# EAGLE schematic ProcessingUnit (EAGLE 9.6.2)
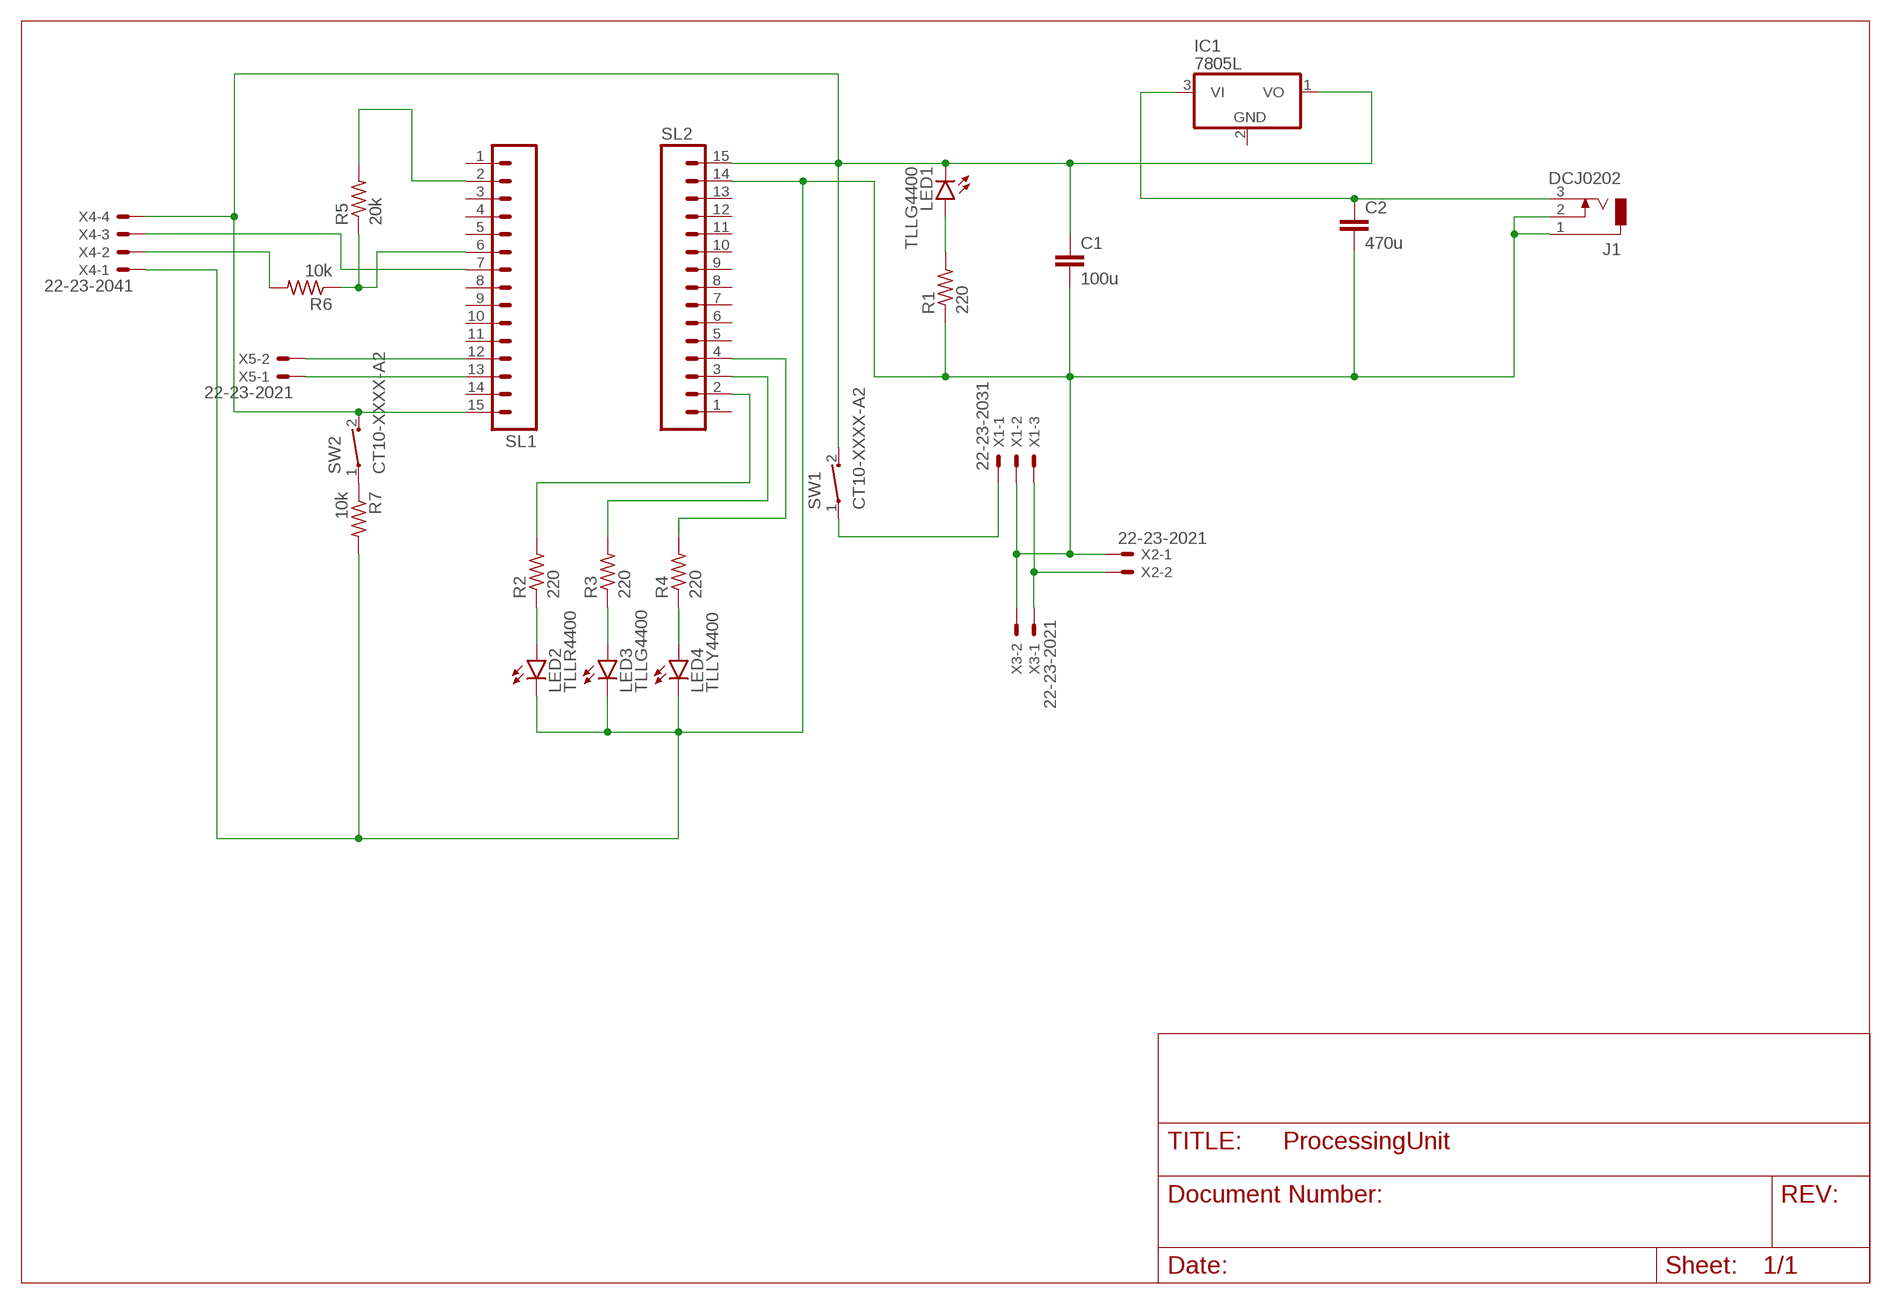
[diagram p0: schematic, sheet 1]

## Parts
C1  100u  C-EU025-025X050  [C025-025X050]
C2  470u  C-EU025-025X050  [C025-025X050]
IC1  7805L  [TO92]
J1  DCJ0202  [DCJ0202]
LED1  TLLG4400  [LED3MM]
LED2  TLLR4400  [LED3MM]
LED3  TLLG4400  [LED3MM]
LED4  TLLY4400  [LED3MM]
R1  220  R-US_0204/7  [0204/7]
R2  220  R-US_0204/7  [0204/7]
R3  220  R-US_0204/7  [0204/7]
R4  220  R-US_0204/7  [0204/7]
R5  20k  R-US_0204/7  [0204/7]
R6  10k  R-US_0204/7  [0204/7]
R7  10k  R-US_0204/7  [0204/7]
SL1  M15  [15P]
SL2  M15  [15P]
SW1  CT10-XXXX-A2  [CT10-XXXX-A2]
SW2  CT10-XXXX-A2  [CT10-XXXX-A2]
X1  22-23-2031  [22-23-2031]
X2  22-23-2021  [22-23-2021]
X3  22-23-2021  [22-23-2021]
X4  22-23-2041  [22-23-2041]
X5  22-23-2021  [22-23-2021]

## Nets
N$1: SL1.13 X5.1
N$2: R5.2 SL1.2
N$3: LED1.A R1.2
N$4: C2.1 IC1.3(VI) J1.3
N$5: SW1.1 X1.1
N$6: LED2.A R2.1
N$7: X1.3 X2.2 X3.1
N$8: R2.2 SL2.2
N$9: R3.2 SL2.3
N$10: R4.2 SL2.4
N$11: LED3.A R3.1
N$12: LED4.A R4.1
N$13: C1.2 C2.2 J1.1 J1.2 LED2.K(C) LED3.K(C) LED4.K(C) R1.1 R7.2 SL2.14 X1.2 X2.1 X3.2 X4.1
N$14: R5.1 R6.1 SL1.6
N$15: R7.1 SW2.1
N$16: R6.2 X4.2
N$17: SL1.7 X4.3
N$18: C1.1 IC1.1(VO) LED1.K(C) SL1.15 SL2.15 SW1.2 SW2.2 X4.4
N$19: SL1.12 X5.2
Unconnected: IC1.2(GND) SL1.1 SL1.3 SL1.4 SL1.5 SL1.8 SL1.9 SL1.10 SL1.11 SL1.14 SL2.1 SL2.5 SL2.6 SL2.7 SL2.8 SL2.9 SL2.10 SL2.11 SL2.12 SL2.13

## Library data of the parts
C1 C2 = rcl:C-EU: CAPACITOR, European symbol; SPICEPREFIX: C
IC1 = linear:78*: Positive VOLTAGE REGULATOR Source: http://cache.national.com/ds/LM/LM78L05.pdf http://www.fairchildsemi.com/ds/LM/LM7805.pdf
J1 = con-jack:DCJ0202: DC POWER JACK Source: DCJ0202.pdf; OC_FARNELL: unknown; OC_NEWARK: unknown
LED1 LED3 = led:TLLG4400: Low Current (2mA) LED 3 mm Tinted Diffused Package color GREEN Source: Data sheet <http://www.farnell.com/datasheets/391098.pdf>; MF: VISHAY SEMICONDUCTOR; OC_FARNELL: 1612435
LED2 = led:TLLR4400: Low Current (2mA) LED 3 mm Tinted Diffused Package color RED Source: Data sheet <http://www.farnell.com/datasheets/391100.pdf>; MF: VISHAY SEMICONDUCTOR; OC_FARNELL: 1612437
LED4 = led:TLLY4400: Low Current (2mA) LED 3 mm Tinted Diffused Package color YELLOW Source: Data sheet <http://www.farnell.com/datasheets/391098.pdf>; MF: VISHAY SEMICONDUCTOR; OC_FARNELL: 1612439
R1 = rcl:R-US_: RESISTOR, American symbol; SPICEPREFIX: R
R2-R7 = resistor:R-US_: RESISTOR, American symbol
SL1 SL2 = con-amp-quick:M15: AMP QUICK CONNECTOR; OC_FARNELL: unknown; OC_NEWARK: unknown
SW1 SW2 = switch-coto:CT10-XXXX-: CT10 Series Molded Switch Source: www.cotorelay.com .. Coto_Technology__CT10-1530-G1.pdf
X1 = con-molex:22-23-2031: .100" (2.54mm) Center Header - 3 Pin; MF: MOLEX; MPN: 22-23-2031; OC_FARNELL: 1462950; OC_NEWARK: 30C0862
X2 X3 X5 = con-molex:22-23-2021: .100" (2.54mm) Center Header - 2 Pin; MF: MOLEX; MPN: 22-23-2021; OC_FARNELL: 1462926; OC_NEWARK: 25C3832
X4 = con-molex:22-23-2041: .100" (2.54mm) Center Header - 4 Pin; MF: MOLEX; MPN: 22-23-2041; OC_FARNELL: 1462920; OC_NEWARK: 38C0355